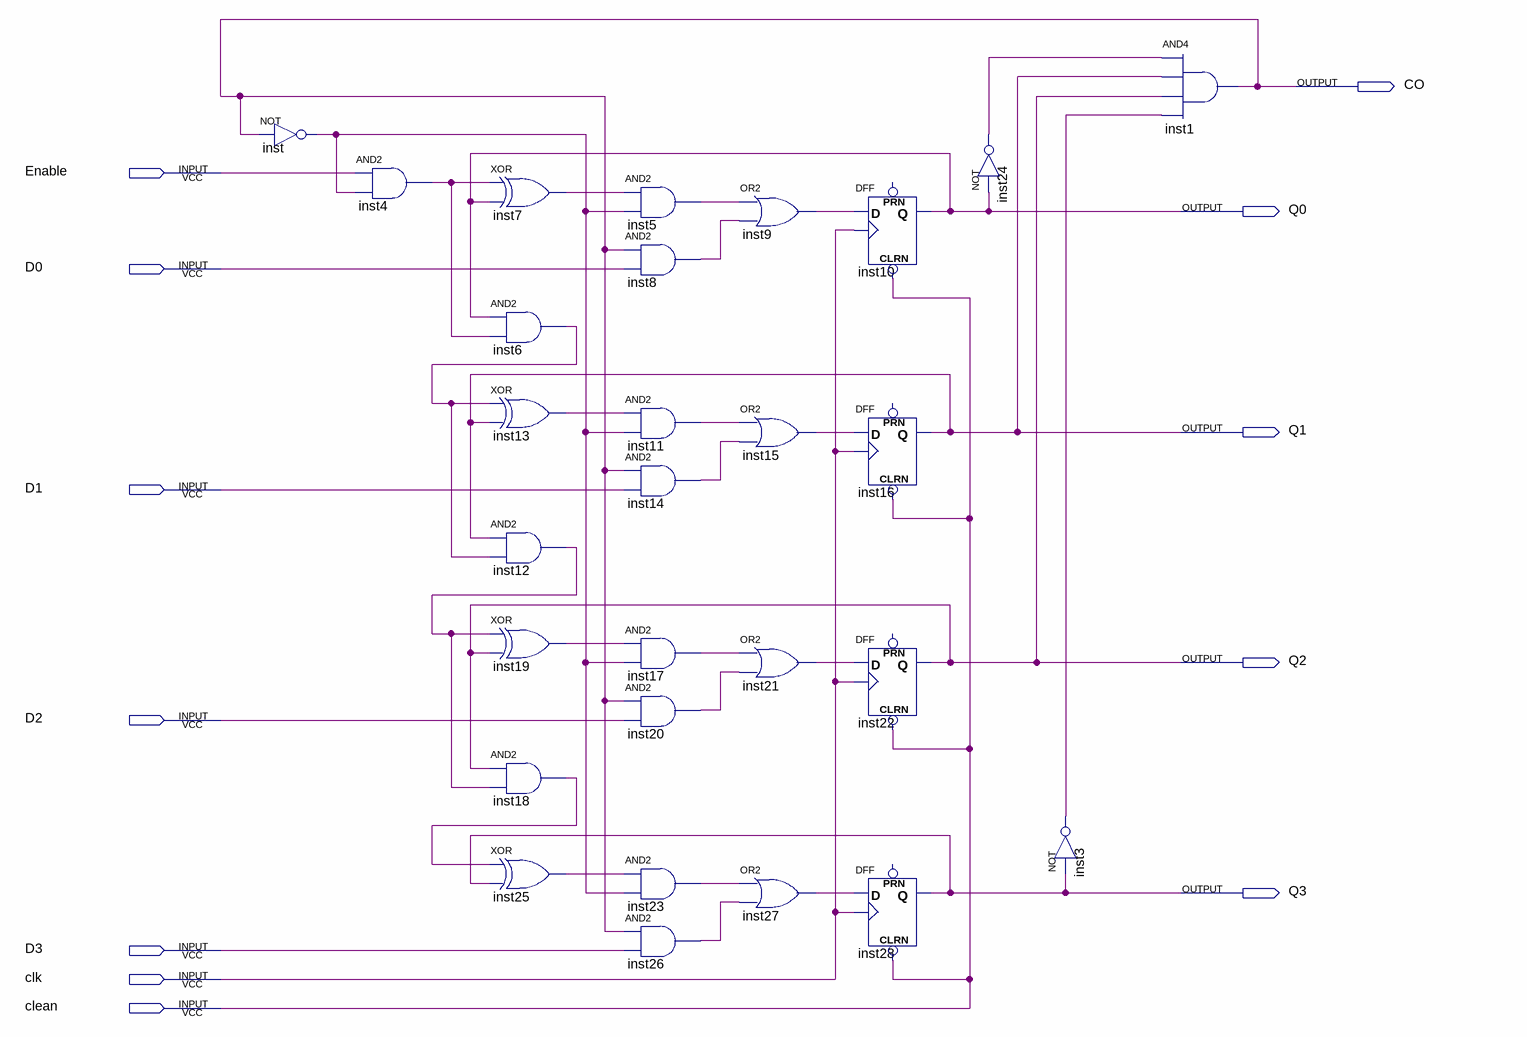
[diagram p0: schematic sheet]
// Quartus schematic Mod6counter.bdf as structural Verilog: 28 symbols, 12 pins
module Mod6counter (
  input  Enable,
  input  D0,
  input  D1,
  input  D2,
  input  D3,
  input  clk,
  input  clean,
  output CO,
  output Q0,
  output Q1,
  output Q2,
  output Q3
);

  wire inst3_out, inst4_out, inst5_out, inst6_out, inst7_out, inst8_out, inst9_out, inst11_out, inst12_out,
       inst13_out, inst14_out, inst15_out, inst17_out, inst18_out, inst19_out, inst20_out, inst21_out,
       inst23_out, inst24_out, inst25_out, inst26_out, inst27_out, inst_out;

  not inst (inst_out, CO);
  and inst4 (inst4_out, Enable, inst_out);
  xor inst7 (inst7_out, inst4_out, Q0);
  and inst6 (inst6_out, Q0, inst4_out);
  xor inst13 (inst13_out, inst6_out, Q1);
  and inst12 (inst12_out, Q1, inst6_out);
  xor inst19 (inst19_out, inst12_out, Q2);
  and inst18 (inst18_out, Q2, inst12_out);
  xor inst25 (inst25_out, inst18_out, Q3);
  and inst5 (inst5_out, inst7_out, inst_out);
  and inst8 (inst8_out, CO, D0);
  and inst11 (inst11_out, inst13_out, inst_out);
  and inst14 (inst14_out, CO, D1);
  and inst17 (inst17_out, inst19_out, inst_out);
  and inst20 (inst20_out, CO, D2);
  and inst23 (inst23_out, inst25_out, inst_out);
  and inst26 (inst26_out, CO, D3);
  or inst9 (inst9_out, inst5_out, inst8_out);
  or inst15 (inst15_out, inst11_out, inst14_out);
  or inst21 (inst21_out, inst17_out, inst20_out);
  or inst27 (inst27_out, inst23_out, inst26_out);
  DFF inst10 (.CLRN(clean), .CLK(clk), .D(inst9_out), .Q(Q0));  // open: PRN
  DFF inst16 (.CLRN(clean), .CLK(clk), .D(inst15_out), .Q(Q1));  // open: PRN
  DFF inst22 (.CLRN(clean), .CLK(clk), .D(inst21_out), .Q(Q2));  // open: PRN
  DFF inst28 (.CLRN(clean), .CLK(clk), .D(inst27_out), .Q(Q3));  // open: PRN
  not inst24 (inst24_out, Q0);
  not inst3 (inst3_out, Q3);
  and inst1 (CO, inst24_out, Q1, Q2, inst3_out);
endmodule
